# Altium schematic sheet Main.SchDoc: =DocumentName
size A4; SheetNumber: 1; SheetTotal: 6
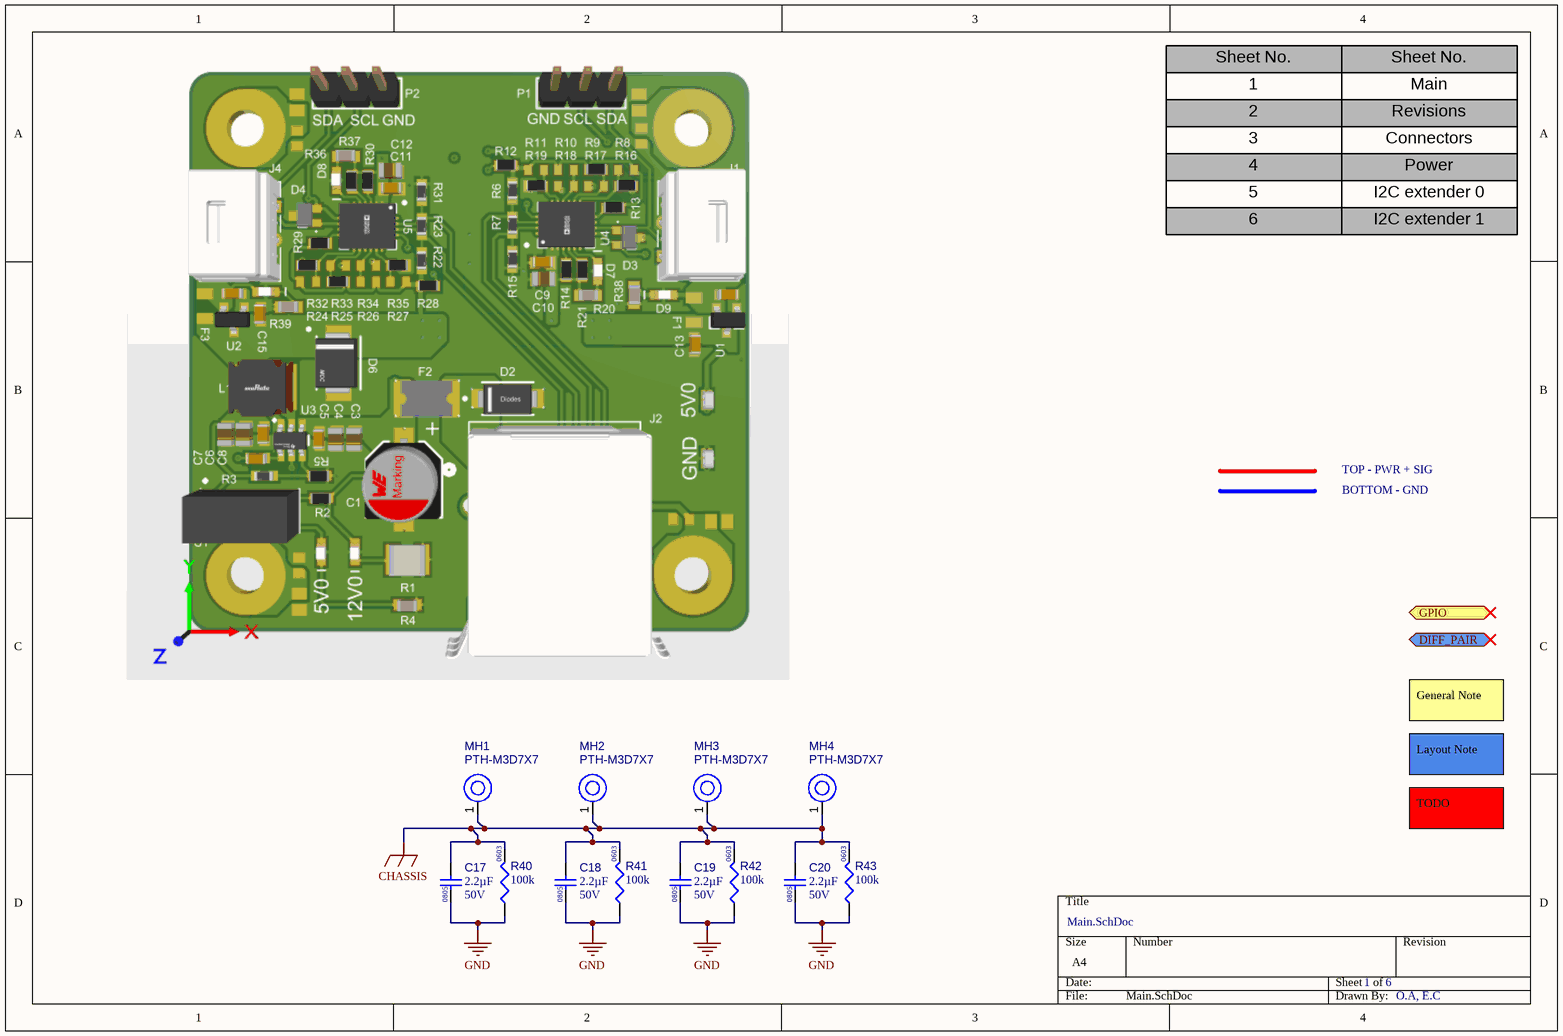
[diagram p0: Main.SchDoc]

## Parts
C17  value 2.2µF  Rated DC Voltage (URdc): 50V  Case/Package: 0805  [FP-CL21-IPC_C]  (hidden comment: CL21A225KBFNNNE)
C18  value 2.2µF  Rated DC Voltage (URdc): 50V  Case/Package: 0805  [FP-CL21-IPC_C]  (hidden comment: CL21A225KBFNNNE)
C19  value 2.2µF  Rated DC Voltage (URdc): 50V  Case/Package: 0805  [FP-CL21-IPC_C]  (hidden comment: CL21A225KBFNNNE)
C20  value 2.2µF  Rated DC Voltage (URdc): 50V  Case/Package: 0805  [FP-CL21-IPC_C]  (hidden comment: CL21A225KBFNNNE)
MH1  PTH-M3D7X7  [PTH-M2D5X5]
MH2  PTH-M3D7X7  [PTH-M2D5X5]
MH3  PTH-M3D7X7  [PTH-M2D5X5]
MH4  PTH-M3D7X7  [PTH-M2D5X5]
R40  value 100k  Case/Package: 0603  [RESC1608X55X25NL10T15]  (hidden comment: RC0603FR-07100KL)
R41  value 100k  Case/Package: 0603  [RESC1608X55X25NL10T15]  (hidden comment: RC0603FR-07100KL)
R42  value 100k  Case/Package: 0603  [RESC1608X55X25NL10T15]  (hidden comment: RC0603FR-07100KL)
R43  value 100k  Case/Package: 0603  [RESC1608X55X25NL10T15]  (hidden comment: RC0603FR-07100KL)

## Ports
DIFF_PAIR (bidir), GPIO (bidir)

## Nets
CHASSIS: C17.2 C18.2 C19.2 C20.2 MH1.1(H1) MH2.1(H1) MH3.1(H1) MH4.1(H1) R40.2 R41.2 R42.2 R43.2
GND: C17.1 C18.1 C19.1 C20.1 R40.1 R41.1 R42.1 R43.1

## Notes on the sheet
- Sheet No.
- 1
- Main
- 2
- 3
- 4
- Revisions
- Connectors
- Power
- 5
- 6
- I2C extender 0
- I2C extender 1
- TOP - PWR + SIG
- BOTTOM - GND
- General Note
- Layout Note
- TODO
- O.A, E.C

## Library data of the parts
C17-C20 = CMP-001-00099-1: Ceramic Capacitor, Multilayer, Ceramic, 50V, 10% +Tol, 10% -Tol, X5R, 15% TC, 2.2uF, Surface Mount, 0805; Multilayer: Yes; Dielectric Material: Ceramic; Length: 2mm; Pins: 2; Tolerance  (fill in as +-): 10%; RoHS Compliant: Yes; Package Style: SMTMeter; Reach SVHC Compliant: Yes; Min Operating Temperature: -55°C; Temperature Characteristics Code: X5R; Tolerance (fill in as +-): 10%; Capacitor Type: Ceramic; Width: 1.25mm; Terminal Finish: Nickel; Termination: Wraparound; Package Shape: Rectangular; Packaging: Tape and Reel; Mounting Technology: Surface Mount; JESD-609 Code: e3; Height: 1.25mm; Max Operating Temperature: 85°C
MH1-MH4 = CMP-00028-00009-3: M3 PTH (3.3mm), 7mm pad; Pins: 1
R40-R43 = CMP-009-00195-1: Fixed Resistor, Metal Glaze/thick Film, 0.1W, 100000ohm, 75V, 1% +/-Tol, 100ppm/Cel, Surface Mount, 0603; Power: 100mW; Voltage Rating: 50V; Package Length: 1.6mm; Package Height: 0.45mm; Rated Temperature: 70°C; Package Width: 0.8mm; Temperature Coefficient: 100ppm/°C; Additional Feature: LASER TRIMMABLE; Pins: 2; Reach SVHC Compliant: Yes; Terminal Finish: Nickel; RoHS Compliant: Yes; Technology: METAL GLAZE/THICK FILM; JESD-609 Code: e3; Working Voltage: 75V; Construction: Chip; Mounting Technology: Surface Mount; Package Style: SMTMeter; Packaging: Tape and Reel; Min Operating Temperature: -55°C; Termination: Wraparound; Tolerance: 1%; Package Shape: Rectangular; Max Operating Temperature: 155°C; Resistor Type: FIXED RESISTOR